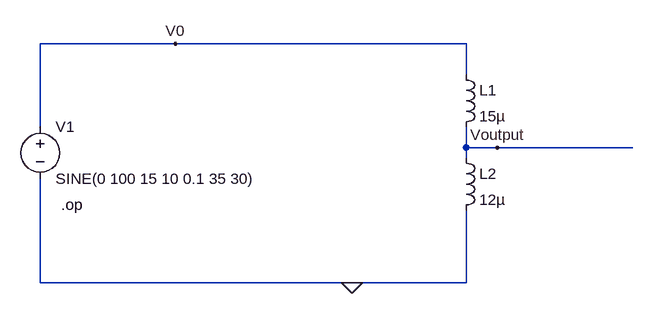
[diagram p0: schematic Inductor-Voltage Divider Circuit.asc]
Inductor-Voltage Divider Circuit.asc, the LTspice schematic file:
Version 4
SHEET 1 932 680
WIRE 224 112 16 112
WIRE 672 112 224 112
WIRE 672 160 672 112
WIRE 16 240 16 112
WIRE 672 272 672 240
WIRE 720 272 672 272
WIRE 928 272 720 272
WIRE 672 288 672 272
WIRE 16 480 16 320
WIRE 496 480 16 480
WIRE 672 480 672 368
WIRE 672 480 496 480
FLAG 496 480 0
FLAG 224 112 V0
FLAG 720 272 Voutput
DATAFLAG 400 112 "$"
DATAFLAG 848 272 "$"
SYMBOL voltage 16 224 R0
SYMATTR InstName V1
SYMATTR Value SINE(0 100 15 10 0.1 35 30)
SYMBOL ind 656 144 R0
SYMATTR InstName L1
SYMATTR Value 15µ
SYMATTR SpiceLine Ipk=1.2 Rser=192m Rpar=25.34K Cpar=2.357p mfg="Bourns, Inc." pn="SDE0403A-150M"
SYMBOL ind 656 272 R0
SYMATTR InstName L2
SYMATTR Value 12µ
SYMATTR SpiceLine Ipk=1.3 Rser=146m Rpar=21.78K Cpar=1.591p mfg="Bourns, Inc." pn="SDE0403A-120M"
TEXT 48 360 Left 2 !.op

The netlist it stands for:
* Inductor-Voltage Divider Circuit.asc
V1 V0 0 SINE(0 100 15 10 0.1 35 30)
L1 V0 Voutput 15µ Ipk=1.2 Rser=192m Rpar=25.34K Cpar=2.357p mfg="Bourns, Inc." pn="SDE0403A-150M"
L2 Voutput 0 12µ Ipk=1.3 Rser=146m Rpar=21.78K Cpar=1.591p mfg="Bourns, Inc." pn="SDE0403A-120M"
.op
.backanno
.end